# Altium schematic sheet Gate Driver.SchDoc
size A4; Author: Esteban Durán Madrid; CompanyName: Universidad de Santiago de Chile; Address1: Avenida Ecuador Nº 3519; Address2: Estación Central, Santiago; Address3: Chile
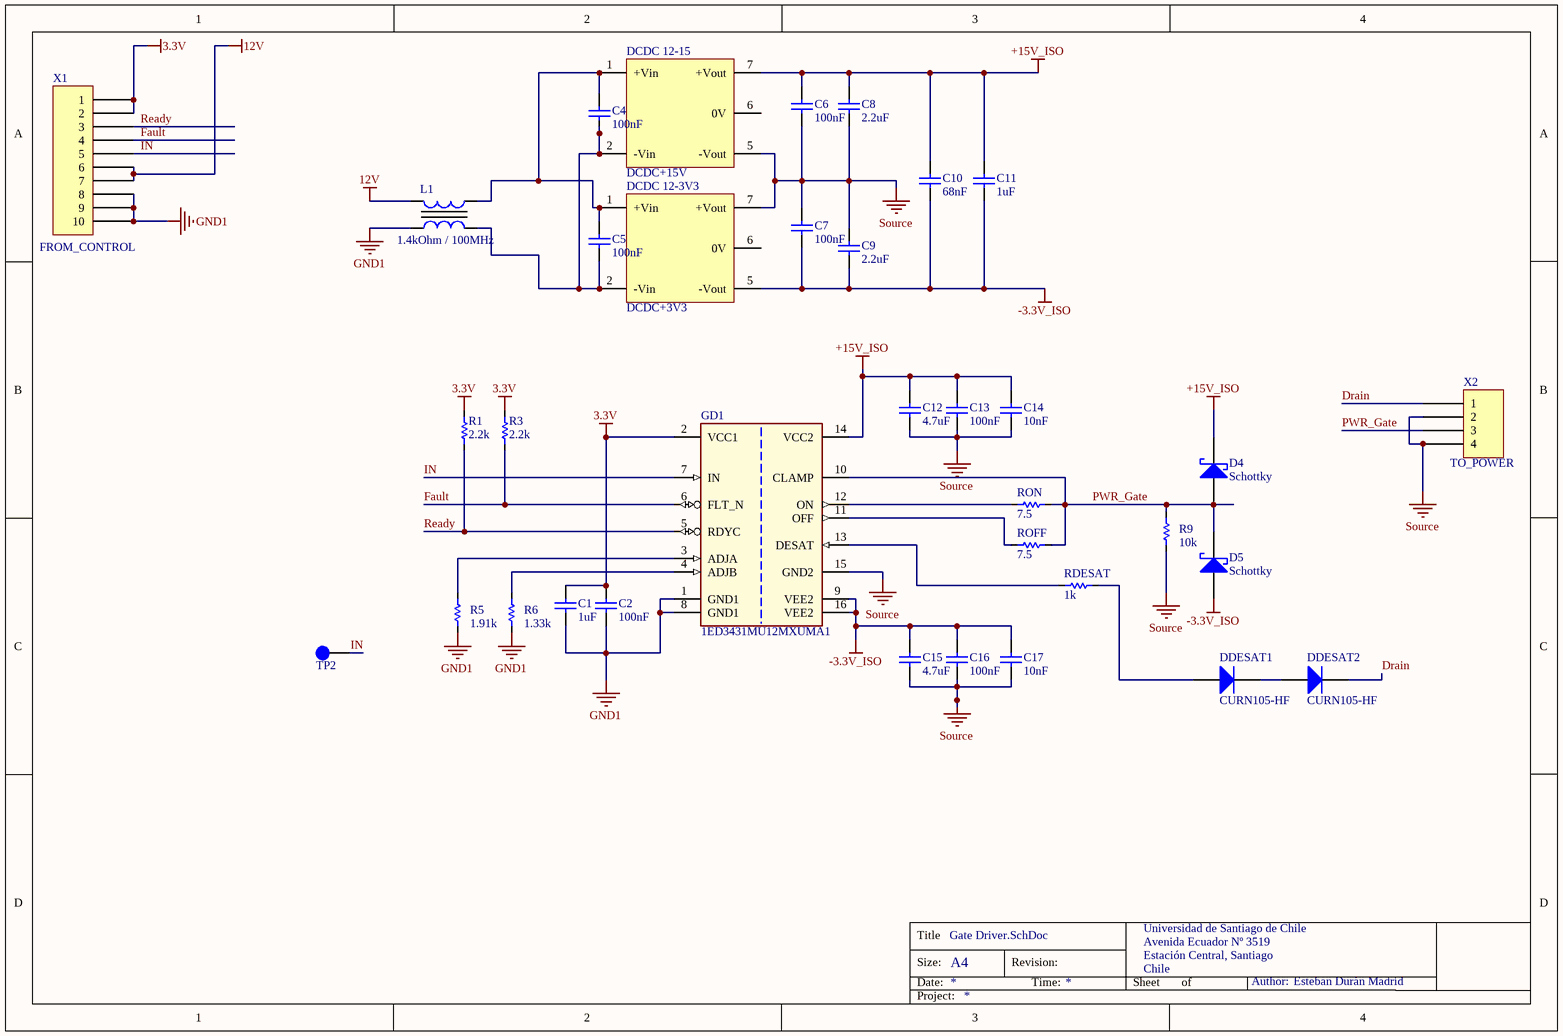
[diagram p0: Gate Driver.SchDoc]

## Parts
C1  1uF  [CAP_0805]
C2  100nF  [CAP_0603]
C4  100nF  [CAP_0603]
C5  100nF  [CAP_0603]
C6  100nF  [CAP_0603]
C7  100nF  [CAP_0603]
C8  2.2uF  [CAP_0805]
C9  2.2uF  [CAP_0805]
C10  68nF  [CAP_0603]
C11  1uF  [CAP_0805]
C12  4.7uF  [CAP_0805]
C13  100nF  [CAP_0603]
C14  10nF  [CAP_0603]
C15  4.7uF  [CAP_0805]
C16  100nF  [CAP_0603]
C17  10nF  [CAP_0603]
D4  Schottky  [SOD-123]
D5  Schottky  [SOD-123]
DCDC_12-3V3  DCDC+3V3  [DC-DC-GEN]
DCDC_12-15  DCDC+15V  [DC-DC-GEN]
DDESAT1  CURN105-HF  [DIODE_1206]
DDESAT2  CURN105-HF  [DIODE_1206]
GD1  1ED3431MU12MXUMA1  [SOP65P1030X265-16N-1]
L1  1.4kOhm / 100MHz  [CHOKE_CM_4.7x4.5mm]
R1  2.2k  [RES_0603]
R3  2.2k  [RES_0603]
R5  1.91k  [RES_0603]
R6  1.33k  [RES_0603]
R9  10k  [RES_0603]
RDESAT  1k  [RES_0603]
ROFF  7.5  [RES_MMB_0207]
RON  7.5  [RES_MMB_0207]
TP2  Gate  [TP_1mm]  (value not drawn)  (no BOM)
X1  FROM_CONTROL  [TMM-110-01-G-S]
X2  TO_POWER  [TMM-104-01-G-S]

## Nets
3.3V: C1.1 C2.1 GD1.2(VCC1) R1.2 R3.2 X1.1 X1.2
12V: L1.3 X1.6 X1.7
+15V_ISO: C6.1 C8.1 C10.1 C11.1 C12.1 C13.1 C14.1 D4.K DCDC_12-15.7(+Vout) GD1.14(VCC2)
-3.3V_ISO: C7.2 C9.2 C10.2 C11.2 C15.1 C16.1 C17.1 D5.A DCDC_12-3V3.5(-Vout) GD1.9(VEE2) GD1.16(VEE2)
GND1: C1.2 C2.2 GD1.1(GND1) GD1.8(GND1) L1.4 R5.1 R6.1 X1.8 X1.9 X1.10
Source: C6.2 C7.1 C8.2 C9.1 C12.2 C13.2 C14.2 C15.2 C16.2 C17.2 DCDC_12-3V3.7(+Vout) DCDC_12-15.5(-Vout) GD1.15(GND2) R9.1 X2.2 X2.4
Drain: DDESAT2.K X2.1
Fault: GD1.6(FLT_N) R3.1 X1.4
IN: GD1.7(IN) TP2.1 X1.5
PWR_Gate: D4.A D5.K GD1.10(CLAMP) R9.2 ROFF.1 RON.1 X2.3
Ready: GD1.5(RDYC) R1.1 X1.3
NetC4_1: C4.1 C5.1 DCDC_12-3V3.1(+Vin) DCDC_12-15.1(+Vin) L1.2
NetC4_2: C4.2 C5.2 DCDC_12-3V3.2(-Vin) DCDC_12-15.2(-Vin) L1.1
NetDDESAT1_A: DDESAT1.A RDESAT.2
NetDDESAT1_K: DDESAT1.K DDESAT2.A
NetGD1_3: GD1.3(ADJA) R5.2
NetGD1_4: GD1.4(ADJB) R6.2
NetGD1_11: GD1.11(OFF) ROFF.2
NetGD1_12: GD1.12(ON) RON.2
NetGD1_13: GD1.13(DESAT) RDESAT.1

Not connected (* = marked no-connect by the designer): DCDC_12-3V3 6(0V); DCDC_12-15 6(0V)

## Notes on the sheet
- Title
- Size:
- Date:
- A4
- Revision:
- Time:
- Sheet
- of
- Author:
- Project:

## Library data of the parts
C1 C11 = Cap_0805: 1µF ±10% 50V Ceramic Capacitor X7R 0805 (2012 Metric); MF: KEMET; MFP: C0805C105K5RACAUTO; Created: 2020_06_15_DAarancibia; Package: 0805; Value: 1uF; MPN: C0805C105K5RACAUTO
C2 C4-C7 C13 C16 = Cap_0805: 0.1µF ±10% 50V Ceramic Capacitor X7R 0603 (2012 Metric); MPN: C0805C104K5RACTU; MF: KEMET; MFP: C0603C104K5RAC3121; Created: 2022_12_31; Package: 0603; Value: 100nF
C8 C9 = Cap_0805: 2.2µF ±10% 50V Ceramic Capacitor X7R 0805 (2012 Metric); MF: KEMET; MFP: C0805X225K5RACAUTO; Package: 0805; Value: 2.2uF
  C8: Created: 2022_12_31
  C9: Created: 2022_31_12
C10 = Cap_0805: 0.1µF ±10% 50V Ceramic Capacitor X7R 0603 (2012 Metric); MPN: C0805C104K5RACTU; MF: KEMET; MFP: C0603C683J5RACTU; Created: 2022_12_31; Package: 0603; Value: 68nF
C12 C15 = Cap_0805: 4.7µF ±10% 35V Ceramic Capacitor X7R 0805 (2012 Metric); MF: murata; MFP: GRM21BZ7YA475ME15L; Created: 2022_12_31; Package: 0805; Value: 4.7uF
C14 C17 = Cap_0805: 0.01µF ±10% 50V Ceramic Capacitor X7R 0603 (2012 Metric); MPN: C0805C104K5RACTU; MF: KEMET; MFP: C0603C103J5RACTM; Created: 2022_12_31; Package: 0603; Value: 10nF
D4 D5 = Diode_Schottky_30V/1A: Diode Schottky 30 V 1A Surface Mount PG-SOD323-2; MF: Infineon Technologies; MFP: BAS3010B03WE6327HTSA1; Created: 2021_05_16_EDuran; Package: SC-76, SOD-323; Value: Schottky; Supplier 1: Digi-Key; Supplier Part Number 1: BAS3010B03WE6327HTSA1CT-ND; MPN: BAS3010B03WE6327HTSA1
DCDC_12-3V3 = DC_DC_123V3: ISOLATED DC-DC CONVERTER 12V INPUT, 3.3V OUTPUT; MPN: TMV 1203SHI; MF: TRACO; Created: 2022_12_31; Package: 7-SIP Module, 5 Leads; Value: DCDC+3V3; MFP: TMV 1203SHI
DCDC_12-15 = DC_DC_1215: ISOLATED DC-DC CONVERTER 12V INPUT, 15V OUTPUT; MPN: TBA 1-1213HI; MF: TRACO; Created: 2022_12_31; Package: 7-SIP Module, 5 Leads; Value: DCDC+15V; MFP: TBA 1-1213HI
DDESAT1 DDESAT2 = Diode_2: Diode Standard 1000V 1A Surface Mount 1206; MFP: CURN105-HF; Created: 2022_31_12; Package: 1206; Value: CURN105-HF
GD1 = 1ED3431MU12M: 3A Gate Driver Capacitive Coupling - Channel PG-DSO-16-28; MF: Infineon Technologies; Package: PG-DSO-16-28; MPN: 1ED3431MU12MXUMA1; Created: 2021_05_15_EDuran; Value: 1ED3431MU12MXUMA1; Supplier 1: Digi-Key; Supplier Part Number 1: 448-1ED3431MU12MXUMA1CT-ND
L1 = Choke_CM_ACM4520: 2 Line Common Mode Choke Surface Mount 1.4 kOhms @ 100MHz 1.7A DCR 80mOhm; MF: TDK Corporation; MFP: ACM4520-142-2P-T000; Created: 2020_07_28_DAarancibia; Package: 4.70mm x 4.50mm; Value: 1.4kOhm / 100MHz; Supplier 1: Digi-Key; Supplier Part Number 1: 445-6136-1-ND; MPN: ACM4520-142-2P-T000
R1 R3 = Res_0603: 2.2 kOhms ±5% 0.1W, 1/10W Chip Resistor 0603 (1608 Metric) Moisture Resistant Thick Film; MF: Bourns Inc.; MFP: CR0603-JW-222ELF; Created: 2020_06_15_DAarancibia; Package: 0603; Value: 2.2k; Supplier 1: Digi-Key; Supplier Part Number 1: CR0603-JW-222ELFCT-ND
R5 = Res_0603: 1.91 kOhms ±1% 0.1W, 1/10W Chip Resistor 0603 (1608 Metric) Moisture Resistant Thick Film; MF: Yageo; MFP: RC0603FR-071K91L; Created: 2020_06_15_DAarancibia; Package: 0603; Value: 1.91k; Supplier 1: Digi-Key; Supplier Part Number 1: 311-1.91KHRCT-ND
R6 = Res_0603: 1.33 kOhms ±1% 0.1W, 1/10W Chip Resistor 0603 (1608 Metric); MF: YAGEO; MFP: RC0603FR-071K33L; Created: 2022_31_12; Package: 0603; Value: 1.33k
R9 = Res_0603: 10 kOhms ±5% 0.1W, 1/10W Chip Resistor 0603 (1608 Metric) Moisture Resistant Thick Film; MF: Yageo; MFP: RC0603JR-0710KP; Created: 2020_06_15_DAarancibia; Package: 0603; Value: 10k; Supplier 1: Digi-Key; Supplier Part Number 1: YAG1309CT-ND
RDESAT = Res_0603: 1 kOhms ±5% 0.25W, 1/4W Chip Resistor 0603 (1608 Metric) Automotive AEC-Q200, Pulse Withstanding Thick Film; MF: Yageo; MFP: SR0603JR-7T1KL; Created: 2020_06_15_DAarancibia; Package: 0603; Value: 1k; Supplier 1: Digi-Key; Supplier Part Number 1: YAG6166CT-ND
ROFF = Res_MELF_0207: 7.5 Ohms ±1% 1W Chip Resistor MELF, 0207 Anti-Sulfur, Automotive AEC-Q200 Thin Film; MF: Vishay Beyschlag; MFP: WRM0207HPC-7R5FT2.; Created: 2022_12_31; Package: MELF 0207; Value: 7.5
RON = Res_MELF_0207: 7.5 Ohms ±1% 1W Chip Resistor MELF, 0207 Anti-Sulfur, Automotive AEC-Q200 Thin Film; MF: Vishay Beyschlag; MFP: WRM0207HPC-7R5FT2; Created: 2022_12_31; Package: MELF 0207; Value: 7.5
TP2 = TP_1mm: Testpoint 1mm; Created: 2018_06_25_AGeiger; Value: Gate
X1 = Con_Header_Male_6: Connector Header Through Hole 10 position 0.079" (2.00mm); MF: Samtec Inc.; MPN: TMM-110-01-G-S; Created: 2021_05_24_EDuran; Package: Through Hole, pitch 0.079" (2.00mm); Value: FROM_CONTROL; Supplier 1: Digi-Key; Supplier Part Number 1: SAM1174-10-ND; MFP: TMM-110-01-G-S
X2 = Con_Header_Male_5: Connector Header Through Hole 4 position 0.079" (2.00mm); MF: Samtec Inc.; MPN: TMM-104-01-G-S; Created: 2021_05_24_EDuran; Package: Through Hole, pitch 0.079" (2.00mm); Value: TO_POWER; Supplier 1: Digi-Key; Supplier Part Number 1: SAM1174-04-ND; MFP: TMM-104-01-G-S